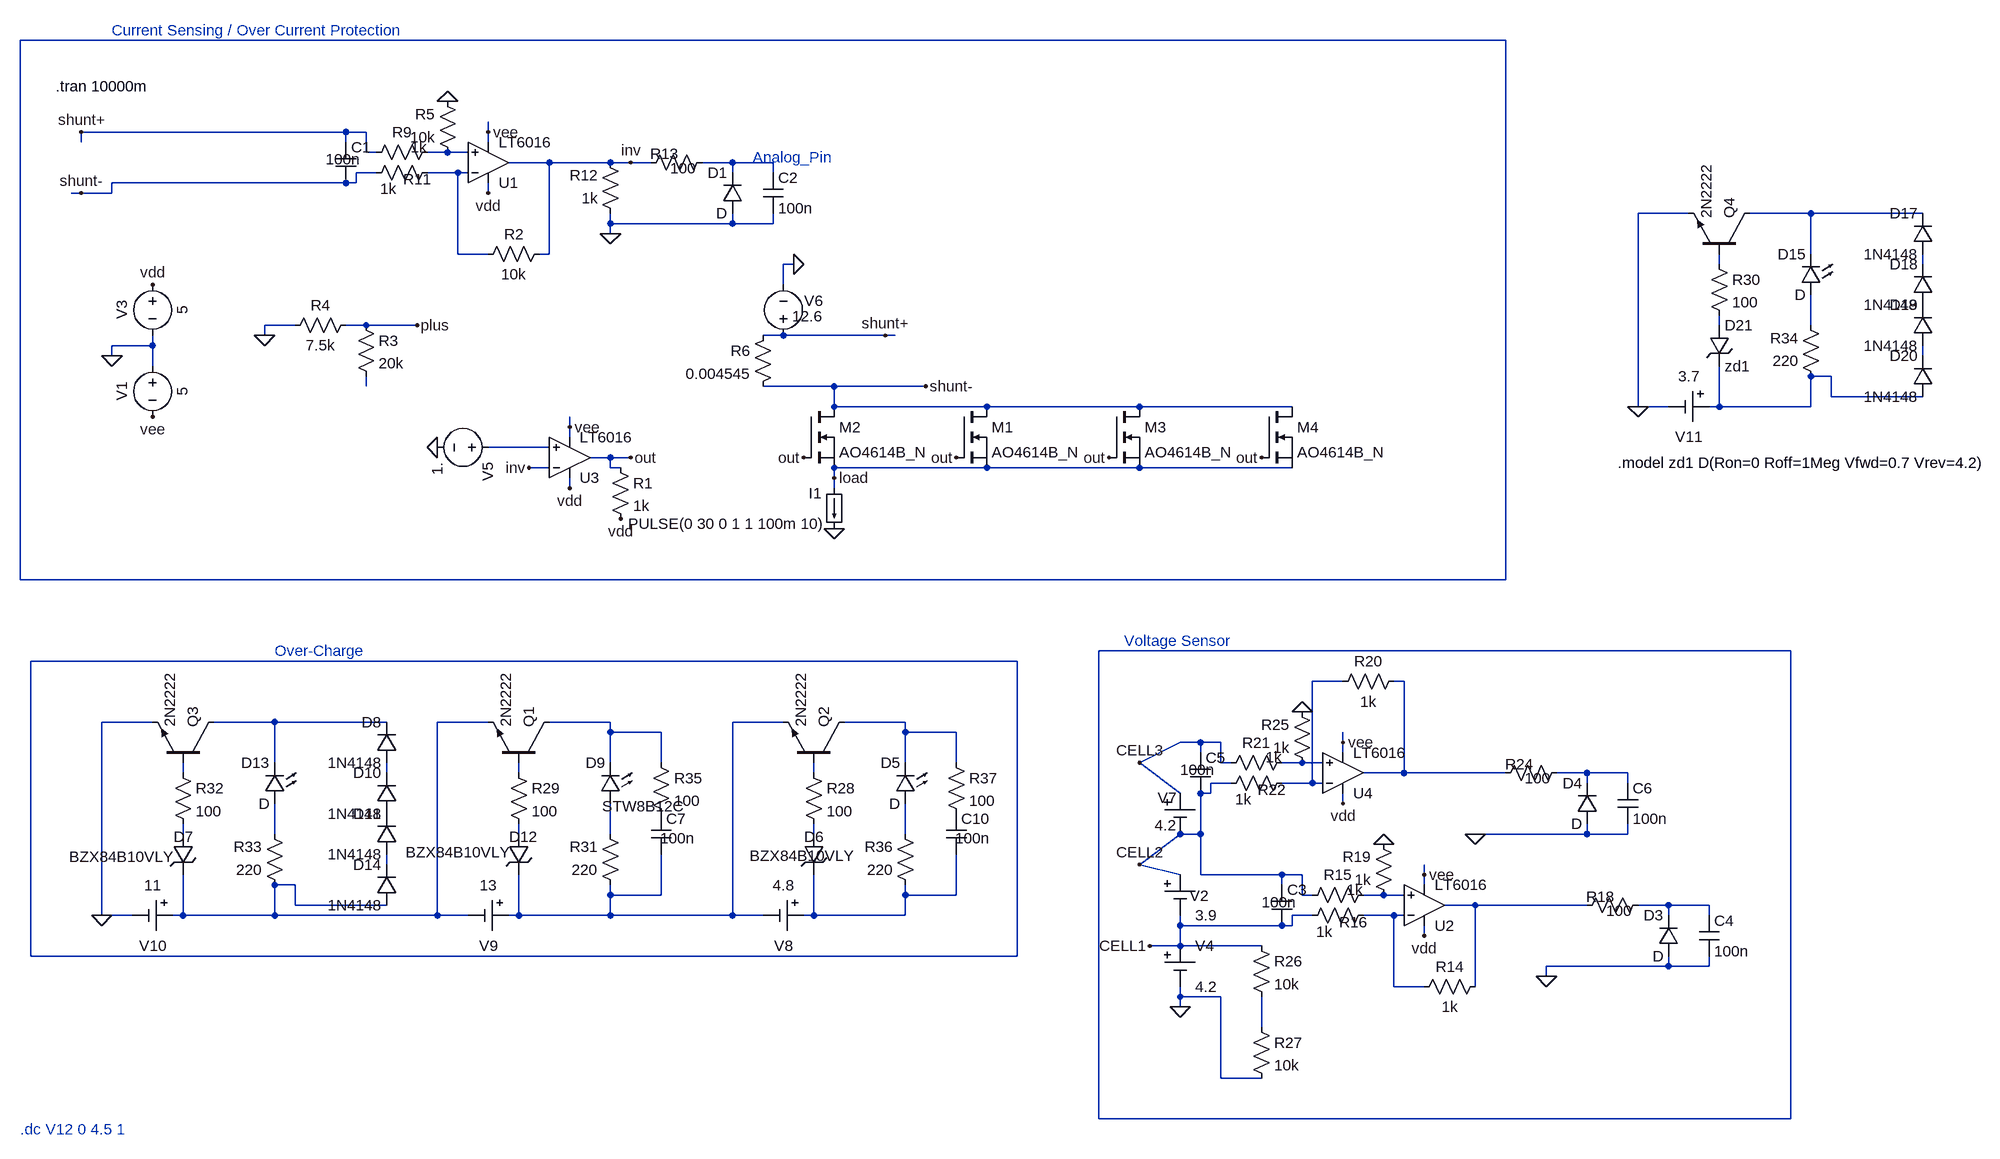
[diagram p0: schematic bms_simulation.asc]
bms_simulation.asc, the LTspice schematic file:
Version 4
SHEET 1 2324 2976
WIRE -512 -2032 -2848 -2032
WIRE -2336 -1888 -2752 -1888
WIRE -2304 -1888 -2336 -1888
WIRE -2112 -1888 -2112 -1904
WIRE -2752 -1872 -2752 -1888
WIRE -2336 -1872 -2336 -1888
WIRE -2112 -1872 -2112 -1888
WIRE -2304 -1856 -2304 -1888
WIRE -2288 -1856 -2304 -1856
WIRE -2176 -1856 -2208 -1856
WIRE -2144 -1856 -2176 -1856
WIRE -2016 -1840 -2080 -1840
WIRE -1920 -1840 -2016 -1840
WIRE -1888 -1840 -1920 -1840
WIRE -1856 -1840 -1888 -1840
WIRE -1728 -1840 -1776 -1840
WIRE -1664 -1840 -1728 -1840
WIRE -2288 -1824 -2320 -1824
WIRE -2160 -1824 -2208 -1824
WIRE -2144 -1824 -2160 -1824
WIRE -1728 -1824 -1728 -1840
WIRE -1664 -1824 -1664 -1840
WIRE -2336 -1808 -2704 -1808
WIRE -2320 -1808 -2320 -1824
WIRE -2320 -1808 -2336 -1808
WIRE -2752 -1792 -2768 -1792
WIRE -2704 -1792 -2704 -1808
WIRE -2704 -1792 -2752 -1792
WIRE -2112 -1792 -2112 -1808
WIRE -224 -1760 -304 -1760
WIRE -32 -1760 -128 -1760
WIRE 144 -1760 -32 -1760
WIRE -1920 -1744 -1920 -1760
WIRE -1728 -1744 -1728 -1760
WIRE -1728 -1744 -1920 -1744
WIRE -1664 -1744 -1664 -1760
WIRE -1664 -1744 -1728 -1744
WIRE -1920 -1728 -1920 -1744
WIRE -2160 -1696 -2160 -1824
WIRE -2112 -1696 -2160 -1696
WIRE -2016 -1696 -2016 -1840
WIRE -2016 -1696 -2032 -1696
WIRE -32 -1696 -32 -1760
WIRE -1632 -1680 -1648 -1680
WIRE -176 -1680 -176 -1696
WIRE 144 -1680 144 -1696
WIRE -1648 -1648 -1648 -1680
WIRE -2416 -1584 -2464 -1584
WIRE -2304 -1584 -2336 -1584
WIRE -2224 -1584 -2304 -1584
WIRE -176 -1584 -176 -1600
WIRE -32 -1584 -32 -1632
WIRE -2464 -1568 -2464 -1584
WIRE -1648 -1568 -1680 -1568
WIRE -1488 -1568 -1648 -1568
WIRE -1472 -1568 -1488 -1568
WIRE -2640 -1552 -2640 -1568
WIRE -2640 -1552 -2704 -1552
WIRE -2704 -1536 -2704 -1552
WIRE 144 -1536 144 -1552
WIRE -2640 -1520 -2640 -1552
WIRE 0 -1504 -32 -1504
WIRE -2304 -1488 -2304 -1504
WIRE -1568 -1488 -1680 -1488
WIRE -1424 -1488 -1568 -1488
WIRE 0 -1472 0 -1504
WIRE 144 -1472 0 -1472
WIRE -1568 -1456 -1568 -1488
WIRE -1328 -1456 -1568 -1456
WIRE -1088 -1456 -1328 -1456
WIRE -848 -1456 -1088 -1456
WIRE -304 -1456 -304 -1760
WIRE -256 -1456 -304 -1456
WIRE -176 -1456 -176 -1520
WIRE -176 -1456 -192 -1456
WIRE -32 -1456 -32 -1504
WIRE -32 -1456 -176 -1456
WIRE -1984 -1424 -1984 -1440
WIRE -1984 -1408 -1984 -1424
WIRE -2016 -1392 -2112 -1392
WIRE -1920 -1376 -1952 -1376
WIRE -1888 -1376 -1920 -1376
WIRE -2016 -1360 -2048 -1360
WIRE -1920 -1360 -1920 -1376
WIRE -1904 -1360 -1920 -1360
WIRE -1328 -1360 -1568 -1360
WIRE -1088 -1360 -1328 -1360
WIRE -848 -1360 -1088 -1360
WIRE -1568 -1344 -1568 -1360
WIRE -1984 -1328 -1984 -1344
WIRE -1568 -1328 -1568 -1344
WIRE -2848 -1184 -2848 -2032
WIRE -512 -1184 -512 -2032
WIRE -512 -1184 -2848 -1184
WIRE -64 -1072 -1152 -1072
WIRE -1280 -1056 -2832 -1056
WIRE -768 -1024 -816 -1024
WIRE -672 -1024 -688 -1024
WIRE -2640 -960 -2720 -960
WIRE -2448 -960 -2544 -960
WIRE -2272 -960 -2448 -960
WIRE -2112 -960 -2192 -960
WIRE -1920 -960 -2016 -960
WIRE -1648 -960 -1728 -960
WIRE -1456 -960 -1552 -960
WIRE -1920 -944 -1920 -960
WIRE -1840 -944 -1920 -944
WIRE -1456 -944 -1456 -960
WIRE -1376 -944 -1456 -944
WIRE -992 -928 -1024 -928
WIRE -960 -928 -992 -928
WIRE -768 -928 -768 -944
WIRE -992 -912 -992 -928
WIRE -768 -912 -768 -928
WIRE -2448 -896 -2448 -960
WIRE -1920 -896 -1920 -944
WIRE -1840 -896 -1840 -944
WIRE -1456 -896 -1456 -944
WIRE -1376 -896 -1376 -944
WIRE -1088 -896 -1024 -928
WIRE -960 -896 -960 -928
WIRE -944 -896 -960 -896
WIRE -832 -896 -864 -896
WIRE -800 -896 -832 -896
WIRE -2592 -880 -2592 -896
WIRE -2272 -880 -2272 -896
WIRE -2064 -880 -2064 -896
WIRE -1600 -880 -1600 -896
WIRE -672 -880 -672 -1024
WIRE -672 -880 -736 -880
WIRE -512 -880 -672 -880
WIRE -384 -880 -432 -880
WIRE -320 -880 -384 -880
WIRE -944 -864 -976 -864
WIRE -816 -864 -816 -1024
WIRE -816 -864 -864 -864
WIRE -800 -864 -816 -864
WIRE -384 -864 -384 -880
WIRE -320 -864 -320 -880
WIRE -1024 -848 -1088 -896
WIRE -976 -848 -976 -864
WIRE -976 -848 -992 -848
WIRE -768 -832 -768 -848
WIRE -2592 -784 -2592 -800
WIRE -2448 -784 -2448 -832
WIRE -2064 -784 -2064 -800
WIRE -1920 -784 -1920 -832
WIRE -1600 -784 -1600 -800
WIRE -1456 -784 -1456 -832
WIRE -992 -784 -992 -848
WIRE -992 -784 -1024 -784
WIRE -560 -784 -576 -784
WIRE -384 -784 -384 -800
WIRE -384 -784 -560 -784
WIRE -320 -784 -320 -800
WIRE -320 -784 -384 -784
WIRE -2272 -736 -2272 -752
WIRE -1088 -736 -1024 -784
WIRE -1024 -720 -1088 -736
WIRE -992 -720 -992 -784
WIRE -864 -720 -992 -720
WIRE -832 -720 -864 -720
WIRE -640 -720 -640 -736
WIRE -2416 -704 -2448 -704
WIRE -864 -704 -864 -720
WIRE -640 -704 -640 -720
WIRE -1920 -688 -1920 -704
WIRE -1840 -688 -1840 -752
WIRE -1840 -688 -1920 -688
WIRE -1456 -688 -1456 -704
WIRE -1376 -688 -1376 -752
WIRE -1376 -688 -1456 -688
WIRE -832 -688 -832 -720
WIRE -816 -688 -832 -688
WIRE -704 -688 -736 -688
WIRE -672 -688 -704 -688
WIRE -2416 -672 -2416 -704
WIRE -2272 -672 -2416 -672
WIRE -560 -672 -608 -672
WIRE -384 -672 -560 -672
WIRE -256 -672 -304 -672
WIRE -192 -672 -256 -672
WIRE -2720 -656 -2720 -960
WIRE -2672 -656 -2720 -656
WIRE -2592 -656 -2592 -720
WIRE -2592 -656 -2608 -656
WIRE -2448 -656 -2448 -704
WIRE -2448 -656 -2592 -656
WIRE -2192 -656 -2192 -960
WIRE -2192 -656 -2448 -656
WIRE -2144 -656 -2192 -656
WIRE -2064 -656 -2064 -720
WIRE -2064 -656 -2080 -656
WIRE -1920 -656 -1920 -688
WIRE -1920 -656 -2064 -656
WIRE -1728 -656 -1728 -960
WIRE -1728 -656 -1920 -656
WIRE -1680 -656 -1728 -656
WIRE -1600 -656 -1600 -720
WIRE -1600 -656 -1616 -656
WIRE -1456 -656 -1456 -688
WIRE -1456 -656 -1600 -656
WIRE -816 -656 -848 -656
WIRE -688 -656 -736 -656
WIRE -672 -656 -688 -656
WIRE -256 -656 -256 -672
WIRE -192 -656 -192 -672
WIRE -1024 -640 -1024 -656
WIRE -864 -640 -1024 -640
WIRE -848 -640 -848 -656
WIRE -848 -640 -864 -640
WIRE -640 -624 -640 -640
WIRE -1024 -608 -1024 -640
WIRE -1024 -608 -1072 -608
WIRE -896 -608 -1024 -608
WIRE -2832 -592 -2832 -1056
WIRE -1280 -592 -1280 -1056
WIRE -1280 -592 -2832 -592
WIRE -256 -576 -256 -592
WIRE -256 -576 -448 -576
WIRE -192 -576 -192 -592
WIRE -192 -576 -256 -576
WIRE -448 -560 -448 -576
WIRE -688 -544 -688 -656
WIRE -640 -544 -688 -544
WIRE -560 -544 -560 -672
WIRE -1024 -528 -1024 -544
WIRE -960 -528 -1024 -528
WIRE -1024 -512 -1024 -528
WIRE -896 -480 -896 -528
WIRE -960 -400 -960 -528
WIRE -896 -400 -960 -400
WIRE -1152 -336 -1152 -1072
WIRE -64 -336 -64 -1072
WIRE -64 -336 -1152 -336
FLAG -2704 -1536 0
FLAG -1920 -1728 0
FLAG -2176 -1936 0
FLAG -2640 -1648 vdd
FLAG -2640 -1440 vee
FLAG -2112 -1792 vdd
FLAG -2112 -1888 vee
FLAG -2464 -1568 0
FLAG -2224 -1584 plus
FLAG -2192 -1392 0
FLAG -1632 -1680 0
FLAG -2048 -1360 inv
FLAG -1488 -1568 shunt+
FLAG -2752 -1888 shunt+
FLAG -2752 -1792 shunt-
FLAG -1424 -1488 shunt-
FLAG -1568 -1264 0
FLAG -1984 -1328 vdd
FLAG -1984 -1424 vee
FLAG -1888 -1376 out
FLAG -1888 -1840 inv
FLAG -1904 -1280 vdd
FLAG -1616 -1376 out
FLAG -1376 -1376 out
FLAG -1136 -1376 out
FLAG -896 -1376 out
FLAG -448 -560 0
FLAG -704 -768 0
FLAG -640 -624 vdd
FLAG -640 -720 vee
FLAG -1024 -512 0
FLAG -832 -976 0
FLAG -768 -832 vdd
FLAG -768 -928 vee
FLAG -2720 -656 0
FLAG -304 -1456 0
FLAG -560 -784 0
FLAG -1568 -1344 load
FLAG -1088 -896 CELL3
FLAG -1088 -736 CELL2
FLAG -1072 -608 CELL1
SYMBOL res -2016 -1712 R90
WINDOW 0 0 56 VBottom 2
WINDOW 3 32 56 VTop 2
SYMATTR InstName R2
SYMATTR Value 10k
SYMBOL res -2192 -1872 R90
WINDOW 0 0 56 VBottom 2
WINDOW 3 -8 29 VTop 2
SYMATTR InstName R9
SYMATTR Value 1k
SYMBOL cap -2352 -1872 R0
WINDOW 3 -16 27 Left 2
SYMATTR Value 100n
SYMATTR InstName C1
SYMBOL res -2192 -1840 R90
WINDOW 0 42 32 VBottom 2
WINDOW 3 26 77 VTop 2
SYMATTR InstName R11
SYMATTR Value 1k
SYMBOL res -1904 -1744 R180
WINDOW 0 36 76 Left 2
WINDOW 3 36 40 Left 2
SYMATTR InstName R12
SYMATTR Value 1k
SYMBOL res -1760 -1856 R90
WINDOW 0 18 75 VBottom 2
WINDOW 3 9 46 VTop 2
SYMATTR InstName R13
SYMATTR Value 100
SYMBOL diode -1712 -1760 R180
WINDOW 0 24 64 Left 2
WINDOW 3 24 0 Left 2
SYMATTR InstName D1
SYMBOL cap -1680 -1824 R0
SYMATTR InstName C2
SYMATTR Value 100n
SYMBOL voltage -2640 -1536 R0
WINDOW 0 -32 56 VBottom 2
WINDOW 3 32 56 VTop 2
WINDOW 123 0 0 Left 0
WINDOW 39 0 0 Left 0
SYMATTR InstName V1
SYMATTR Value 5
SYMBOL res -2160 -1840 R180
WINDOW 0 36 76 Left 2
WINDOW 3 36 40 Left 2
SYMATTR InstName R5
SYMATTR Value 10k
SYMBOL OpAmps\\LT6016 -2112 -1840 M180
SYMATTR InstName U1
SYMBOL voltage -2640 -1664 R0
WINDOW 0 -32 56 VBottom 2
WINDOW 3 32 56 VTop 2
WINDOW 123 0 0 Left 0
WINDOW 39 0 0 Left 0
SYMATTR InstName V3
SYMATTR Value 5
SYMBOL voltage -2096 -1392 R90
WINDOW 123 0 0 Left 0
WINDOW 39 0 0 Left 0
SYMATTR InstName V5
SYMATTR Value 1.
SYMBOL res -2320 -1600 R0
SYMATTR InstName R3
SYMATTR Value 20k
SYMBOL res -2320 -1600 R90
WINDOW 0 0 56 VBottom 2
WINDOW 3 32 56 VTop 2
SYMATTR InstName R4
SYMATTR Value 7.5k
SYMBOL res -1664 -1584 M0
SYMATTR InstName R6
SYMATTR Value 0.004545
SYMATTR SpiceLine pwr=10
SYMBOL voltage -1648 -1552 M180
WINDOW 0 33 71 Left 2
WINDOW 3 14 46 Left 2
WINDOW 123 0 0 Left 0
WINDOW 39 0 0 Left 0
SYMATTR InstName V6
SYMATTR Value 12.6
SYMBOL load -1552 -1328 M0
WINDOW 123 0 0 Left 0
WINDOW 39 0 0 Left 0
SYMATTR InstName I1
SYMATTR Value PULSE(0 30 0 1 1 100m 10)
SYMBOL OpAmps\\LT6016 -1984 -1376 M180
SYMATTR InstName U3
SYMBOL res -1920 -1376 R0
SYMATTR InstName R1
SYMATTR Value 1k
SYMBOL nmos -1616 -1456 R0
SYMATTR InstName M2
SYMATTR Value AO4614B_N
SYMBOL nmos -1376 -1456 R0
SYMATTR InstName M1
SYMATTR Value AO4614B_N
SYMBOL nmos -1136 -1456 R0
SYMATTR InstName M3
SYMATTR Value AO4614B_N
SYMBOL nmos -896 -1456 R0
SYMATTR InstName M4
SYMATTR Value AO4614B_N
SYMBOL res -544 -560 R90
WINDOW 0 0 56 VBottom 2
WINDOW 3 32 56 VTop 2
SYMATTR InstName R14
SYMATTR Value 1k
SYMBOL res -720 -704 R90
WINDOW 0 0 56 VBottom 2
WINDOW 3 -8 29 VTop 2
SYMATTR InstName R15
SYMATTR Value 1k
SYMBOL cap -880 -704 R0
WINDOW 3 -16 27 Left 2
SYMATTR Value 100n
SYMATTR InstName C3
SYMBOL res -720 -672 R90
WINDOW 0 42 32 VBottom 2
WINDOW 3 26 77 VTop 2
SYMATTR InstName R16
SYMATTR Value 1k
SYMBOL res -288 -688 R90
WINDOW 0 18 75 VBottom 2
WINDOW 3 9 46 VTop 2
SYMATTR InstName R18
SYMATTR Value 100
SYMBOL diode -240 -592 R180
WINDOW 0 24 64 Left 2
WINDOW 3 24 0 Left 2
SYMATTR InstName D3
SYMBOL cap -208 -656 R0
SYMATTR InstName C4
SYMATTR Value 100n
SYMBOL res -688 -672 R180
WINDOW 0 36 76 Left 2
WINDOW 3 36 40 Left 2
SYMATTR InstName R19
SYMATTR Value 1k
SYMBOL OpAmps\\LT6016 -640 -672 M180
SYMATTR InstName U2
SYMBOL Misc\\cell -1024 -720 R0
WINDOW 123 0 0 Left 0
WINDOW 39 0 0 Left 0
WINDOW 0 15 33 Left 2
SYMATTR InstName V2
SYMATTR Value 3.9
SYMBOL Misc\\cell -1024 -608 R0
WINDOW 123 0 0 Left 0
WINDOW 39 0 0 Left 0
SYMATTR InstName V4
SYMATTR Value 4.2
SYMBOL Misc\\cell -1024 -848 R0
WINDOW 123 0 0 Left 0
WINDOW 39 0 0 Left 0
WINDOW 0 -35 7 Left 2
WINDOW 3 -40 50 Left 2
SYMATTR InstName V7
SYMATTR Value 4.2
SYMBOL res -672 -1040 R90
WINDOW 0 0 56 VBottom 2
WINDOW 3 32 56 VTop 2
SYMATTR InstName R20
SYMATTR Value 1k
SYMBOL res -848 -912 R90
WINDOW 0 0 56 VBottom 2
WINDOW 3 -8 29 VTop 2
SYMATTR InstName R21
SYMATTR Value 1k
SYMBOL cap -1008 -912 R0
WINDOW 3 -16 27 Left 2
SYMATTR Value 100n
SYMATTR InstName C5
SYMBOL res -848 -880 R90
WINDOW 0 42 32 VBottom 2
WINDOW 3 26 77 VTop 2
SYMATTR InstName R22
SYMATTR Value 1k
SYMBOL res -416 -896 R90
WINDOW 0 18 75 VBottom 2
WINDOW 3 9 46 VTop 2
SYMATTR InstName R24
SYMATTR Value 100
SYMBOL diode -368 -800 R180
WINDOW 0 24 64 Left 2
WINDOW 3 24 0 Left 2
SYMATTR InstName D4
SYMBOL cap -336 -864 R0
SYMATTR InstName C6
SYMATTR Value 100n
SYMBOL res -816 -880 R180
WINDOW 0 36 76 Left 2
WINDOW 3 36 40 Left 2
SYMATTR InstName R25
SYMATTR Value 1k
SYMBOL OpAmps\\LT6016 -768 -880 M180
SYMATTR InstName U4
SYMBOL res -912 -624 R0
SYMATTR InstName R26
SYMATTR Value 10k
SYMBOL res -912 -496 R0
SYMATTR InstName R27
SYMATTR Value 10k
SYMBOL res -1616 -896 R0
SYMATTR InstName R28
SYMATTR Value 100
SYMBOL LED -1440 -832 R180
WINDOW 0 24 64 Left 2
WINDOW 3 24 0 Left 2
SYMATTR InstName D5
SYMBOL Misc\\cell -1616 -656 R90
WINDOW 0 32 32 VTop 2
WINDOW 3 -32 32 VBottom 2
WINDOW 123 0 0 Left 0
WINDOW 39 0 0 Left 0
SYMATTR InstName V8
SYMATTR Value 4.8
SYMBOL res -2080 -896 R0
SYMATTR InstName R29
SYMATTR Value 100
SYMBOL res -1904 -688 R180
WINDOW 0 36 76 Left 2
WINDOW 3 36 40 Left 2
SYMATTR InstName R31
SYMATTR Value 220
SYMBOL LED -1904 -832 R180
WINDOW 0 24 64 Left 2
WINDOW 3 -98 -4 Left 2
SYMATTR InstName D9
SYMATTR Value STW8B12C
SYMBOL Misc\\cell -2080 -656 R90
WINDOW 0 32 32 VTop 2
WINDOW 3 -32 32 VBottom 2
WINDOW 123 0 0 Left 0
WINDOW 39 0 0 Left 0
SYMATTR InstName V9
SYMATTR Value 13
SYMBOL zener -2080 -784 R0
WINDOW 0 1 4 Left 2
WINDOW 3 -162 29 Left 2
SYMATTR InstName D12
SYMATTR Value BZX84B10VLY
SYMBOL npn -2544 -896 M270
SYMATTR InstName Q3
SYMATTR Value 2N2222
SYMBOL res -2608 -896 R0
SYMATTR InstName R32
SYMATTR Value 100
SYMBOL res -2432 -688 R180
WINDOW 0 36 76 Left 2
WINDOW 3 36 40 Left 2
SYMATTR InstName R33
SYMATTR Value 220
SYMBOL LED -2432 -832 R180
WINDOW 0 24 64 Left 2
WINDOW 3 24 0 Left 2
SYMATTR InstName D13
SYMBOL Misc\\cell -2608 -656 R90
WINDOW 0 32 32 VTop 2
WINDOW 3 -32 32 VBottom 2
WINDOW 123 0 0 Left 0
WINDOW 39 0 0 Left 0
SYMATTR InstName V10
SYMATTR Value 11
SYMBOL npn -2016 -896 M270
SYMATTR InstName Q1
SYMATTR Value 2N2222
SYMBOL npn -1552 -896 M270
SYMATTR InstName Q2
SYMATTR Value 2N2222
SYMBOL zener -1616 -784 R0
WINDOW 0 1 4 Left 2
WINDOW 3 -85 34 Left 2
SYMATTR InstName D6
SYMATTR Value BZX84B10VLY
SYMBOL zener -2608 -784 R0
WINDOW 0 1 4 Left 2
WINDOW 3 -163 36 Left 2
SYMATTR InstName D7
SYMATTR Value BZX84B10VLY
SYMBOL cap -1856 -816 R0
WINDOW 3 14 39 Left 2
SYMATTR Value 100n
SYMATTR InstName C7
SYMBOL res -1856 -912 R0
SYMATTR InstName R35
SYMATTR Value 100
SYMBOL res -1440 -688 R180
WINDOW 0 36 76 Left 2
WINDOW 3 36 40 Left 2
SYMATTR InstName R36
SYMATTR Value 220
SYMBOL cap -1392 -816 R0
WINDOW 3 14 39 Left 2
SYMATTR Value 100n
SYMATTR InstName C10
SYMBOL res -1392 -912 R0
SYMATTR InstName R37
SYMATTR Value 100
SYMBOL diode -2256 -896 R180
WINDOW 0 24 64 Left 2
WINDOW 3 24 0 Left 2
SYMATTR InstName D8
SYMATTR Value 1N4148
SYMBOL diode -2256 -816 R180
WINDOW 0 24 64 Left 2
WINDOW 3 24 0 Left 2
SYMATTR InstName D10
SYMATTR Value 1N4148
SYMBOL diode -2256 -752 R180
WINDOW 0 24 64 Left 2
WINDOW 3 24 0 Left 2
SYMATTR InstName D11
SYMATTR Value 1N4148
SYMBOL diode -2256 -672 R180
WINDOW 0 24 64 Left 2
WINDOW 3 24 0 Left 2
SYMATTR InstName D14
SYMATTR Value 1N4148
SYMBOL npn -128 -1696 M270
SYMATTR InstName Q4
SYMATTR Value 2N2222
SYMBOL res -192 -1696 R0
SYMATTR InstName R30
SYMATTR Value 100
SYMBOL res -16 -1488 R180
WINDOW 0 36 76 Left 2
WINDOW 3 36 40 Left 2
SYMATTR InstName R34
SYMATTR Value 220
SYMBOL LED -16 -1632 R180
WINDOW 0 24 64 Left 2
WINDOW 3 24 0 Left 2
SYMATTR InstName D15
SYMBOL Misc\\cell -192 -1456 R90
WINDOW 0 32 32 VTop 2
WINDOW 3 -32 32 VBottom 2
WINDOW 123 0 0 Left 0
WINDOW 39 0 0 Left 0
SYMATTR InstName V11
SYMATTR Value 3.7
SYMBOL diode 160 -1696 R180
WINDOW 0 24 64 Left 2
WINDOW 3 24 0 Left 2
SYMATTR InstName D17
SYMATTR Value 1N4148
SYMBOL diode 160 -1616 R180
WINDOW 0 24 64 Left 2
WINDOW 3 24 0 Left 2
SYMATTR InstName D18
SYMATTR Value 1N4148
SYMBOL diode 160 -1552 R180
WINDOW 0 24 64 Left 2
WINDOW 3 24 0 Left 2
SYMATTR InstName D19
SYMATTR Value 1N4148
SYMBOL diode 160 -1472 R180
WINDOW 0 24 64 Left 2
WINDOW 3 24 0 Left 2
SYMATTR InstName D20
SYMATTR Value 1N4148
SYMBOL zener -192 -1584 R0
SYMATTR InstName D21
SYMATTR Value zd1
TEXT -2792 -1960 Left 2 !.tran 10000m
TEXT -1112 -1088 Left 2 ;Voltage Sensor
TEXT -2704 -2048 Left 2 ;Current Sensing / Over Current Protection
TEXT -2448 -1072 Left 2 ;Over-Charge
TEXT -1696 -1848 Left 2 ;Analog_Pin
TEXT -336 -1368 Left 2 !.model zd1 D(Ron=0 Roff=1Meg Vfwd=0.7 Vrev=4.2)
TEXT -2848 -320 Left 2 ;.dc V12 0 4.5 1

The netlist it stands for:
* bms_simulation.asc
R2 inv N004 10k
R9 N002 shunt+ 1k
C1 shunt+ shunt- 100n
R11 N004 shunt- 1k
R12 0 inv 1k
R13 N003 inv 100
D1 0 N003 D
C2 N003 0 100n
V1 0 vee 5
R5 N002 0 10k
* U1: LT6016 (symbol OpAmps\LT6016 not available, pins judged from their places): In+=N002 In-=N004 V+=vdd V-=vee OUT=inv
V3 vdd 0 5
V5 N013 0 1.
R3 plus N012 20k
R4 plus 0 7.5k
R6 shunt+ shunt- 0.004545 pwr=10
V6 shunt+ 0 12.6
I1 load 0 PULSE(0 30 0 1 1 100m 10)
* U3: LT6016 (symbol OpAmps\LT6016 not available, pins judged from their places): In+=N013 In-=inv V+=vdd V-=vee OUT=out
R1 out vdd 1k
M2 shunt- out load load AO4614B_N
M1 shunt- out load load AO4614B_N
M3 shunt- out load load AO4614B_N
M4 shunt- out load load AO4614B_N
R14 N038 N040 1k
R15 N037 CELL2 1k
C3 CELL2 CELL1 100n
R16 N040 CELL1 1k
R18 N039 N038 100
D3 0 N039 D
C4 N039 0 100n
R19 N037 0 1k
* U2: LT6016 (symbol OpAmps\LT6016 not available, pins judged from their places): In+=N037 In-=N040 V+=vdd V-=vee OUT=N038
V2 CELL2 CELL1 3.9
V4 CELL1 0 4.2
V7 CELL3 CELL2 4.2
R20 N017 N016 1k
R21 N023 CELL3 1k
C5 CELL3 CELL2 100n
R22 N016 CELL2 1k
R24 N028 N017 100
D4 0 N028 D
C6 N028 0 100n
R25 N023 0 1k
* U4: LT6016 (symbol OpAmps\LT6016 not available, pins judged from their places): In+=N023 In-=N016 V+=vdd V-=vee OUT=N017
R26 CELL1 N041 10k
R27 N041 0 10k
R28 N027 N033 100
D5 N034 N022 D
V8 N036 N021 4.8
R29 N026 N031 100
R31 N021 N032 220
D9 N032 N020 STW8B12C
V9 N021 N019 13
D12 N031 N021 BZX84B10VLY
Q3 N018 N024 0 0 2N2222
R32 N024 N029 100
R33 N019 N030 220
D13 N030 N018 D
V10 N019 0 11
Q1 N020 N026 N019 0 2N2222
Q2 N022 N027 N021 0 2N2222
D6 N033 N036 BZX84B10VLY
D7 N029 N019 BZX84B10VLY
C7 P001 N021 100n
R35 N020 P001 100
R36 N036 N034 220
C10 P002 N036 100n
R37 N022 P002 100
D8 N025 N018 1N4148
D10 P003 N025 1N4148
D11 N035 P003 1N4148
D14 N019 N035 1N4148
Q4 N005 N006 0 0 2N2222
R30 N006 N008 100
R34 N011 N009 220
D15 N009 N005 D
V11 N011 0 3.7
D17 N007 N005 1N4148
D18 P004 N007 1N4148
D19 N010 P004 1N4148
D20 N011 N010 1N4148
D21 N008 N011 zd1
.model D D
.lib standard.dio
.model NPN NPN
.model PNP PNP
.lib standard.bjt
.model NMOS NMOS
.model PMOS PMOS
.lib standard.mos
.tran 10000m
* Voltage Sensor
* Current Sensing / Over Current Protection
* Over-Charge
* Analog_Pin
.model zd1 D(Ron=0 Roff=1Meg Vfwd=0.7 Vrev=4.2)
* .dc V12 0 4.5 1
.backanno
.end